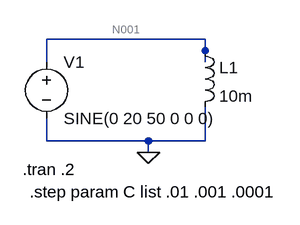
[diagram p0: schematic Draft4.asc]
Draft4.asc, the LTspice schematic file:
Version 4
SHEET 1 880 680
WIRE 304 48 80 48
WIRE 304 64 304 48
WIRE 80 80 80 48
WIRE 304 80 304 64
WIRE 80 192 80 160
WIRE 224 192 80 192
WIRE 304 192 304 144
WIRE 304 192 224 192
WIRE 224 208 224 192
FLAG 224 208 0
SYMBOL voltage 80 64 R0
WINDOW 123 0 0 Left 0
WINDOW 39 0 0 Left 0
SYMATTR InstName V1
SYMATTR Value SINE(0 20 50 0 0 0)
SYMBOL ind 288 48 R0
SYMATTR InstName L1
SYMATTR Value 10m
SYMATTR SpiceLine Rser=1
TEXT 46 232 Left 2 !.tran .2
TEXT 56 264 Left 2 !.step param C list .01 .001 .0001

The netlist it stands for:
* Draft4.asc
V1 N001 0 SINE(0 20 50 0 0 0)
L1 N001 0 10m Rser=1
.tran .2
.step param C list .01 .001 .0001
.backanno
.end

* Results of the author's LTspice run, read from the files saved beside the schematic
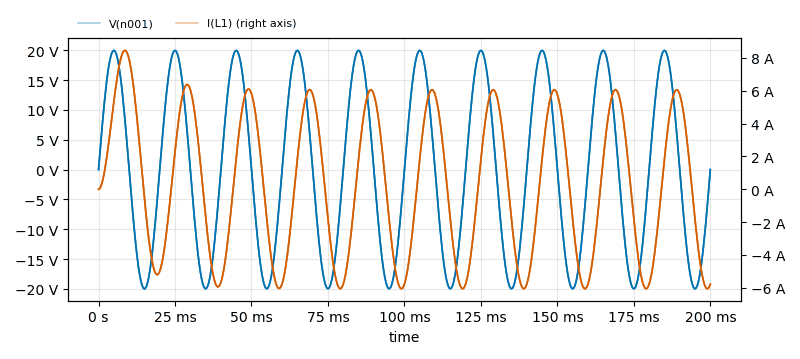
[diagram p1: Transient Analysis of Draft4.asc, plotted from the saved traces]
* Transient Analysis, 3 runs:
*   V(n001) [c=0.0001]: min -20 V, max 20 V, average -32.34 µV, rms 14.14 V, last 0 V
*   V(n001) [c=0.001]: min -20 V, max 20 V, average -52.36 µV, rms 14.14 V, last 0 V
*   V(n001) [c=0.01]: min -20 V, max 20 V, average -52.36 µV, rms 14.14 V, last 0 V
*   I(L1) [c=0.0001]: min -6.059 A, max 8.452 A, average 288.9 mA, rms 4.38 A, last -5.779 A
*   I(L1) [c=0.001]: min -6.059 A, max 8.452 A, average 288.9 mA, rms 4.38 A, last -5.779 A
*   I(L1) [c=0.01]: min -6.059 A, max 8.452 A, average 288.9 mA, rms 4.38 A, last -5.779 A